# Altium project ADV7611.PrjPcb
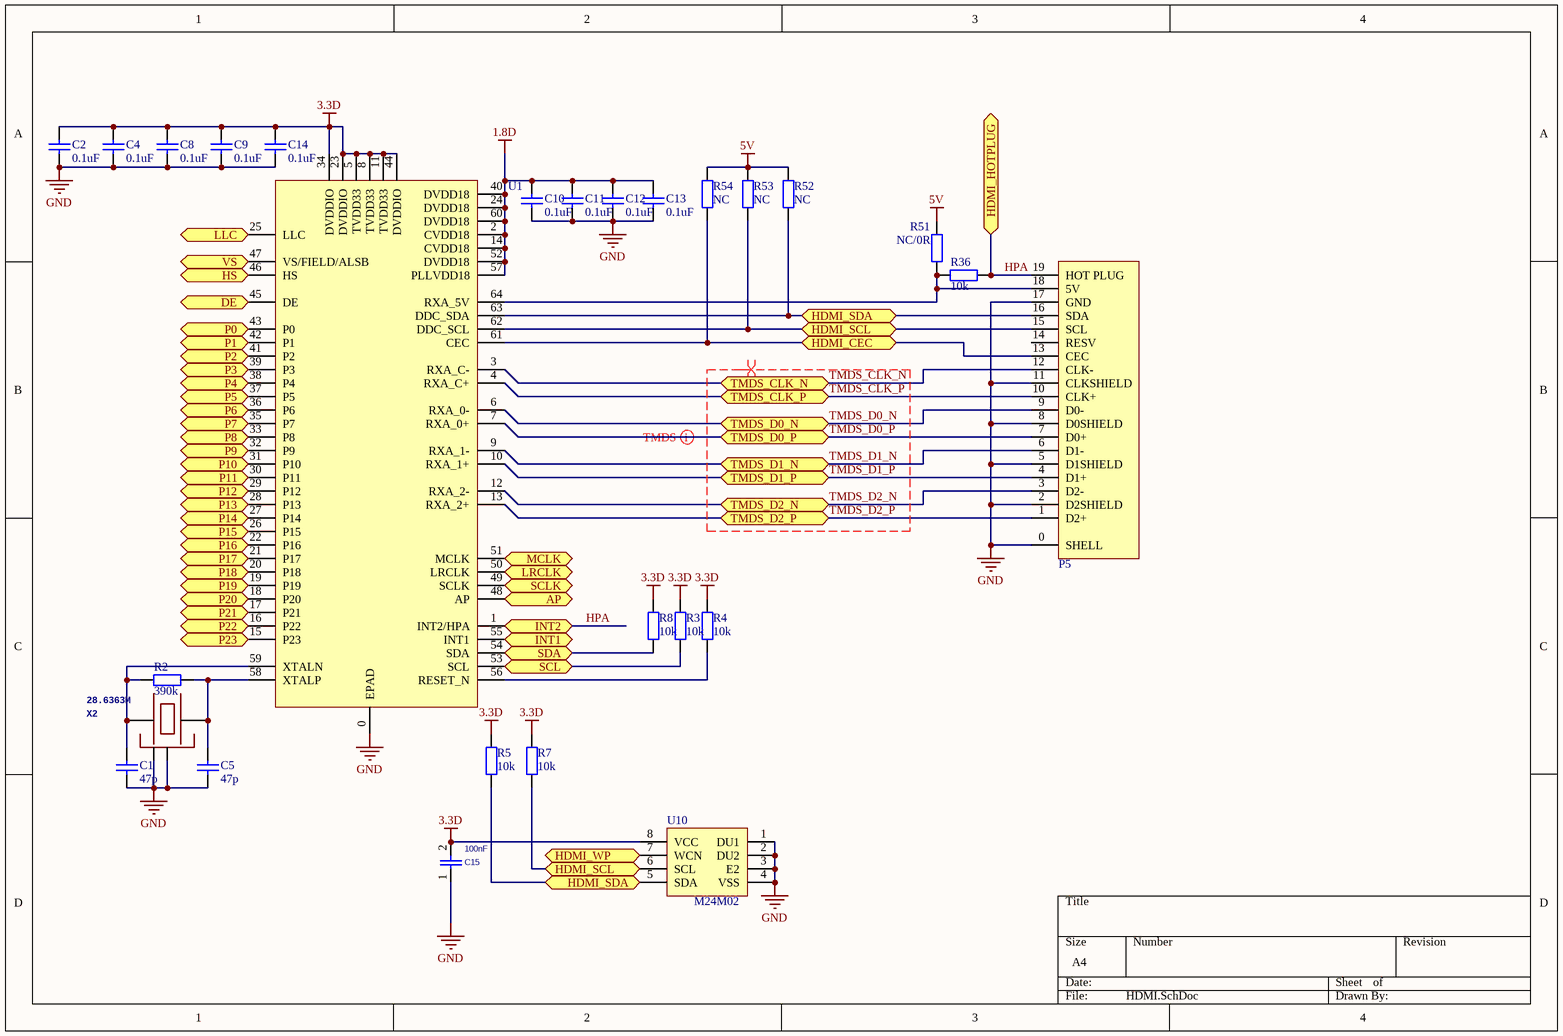
[diagram p0: HDMI.SchDoc]
3 sheets, 57 parts. Net scope: flat (ports and power ports of the same name join across sheets).
Board file: ADV7611.PcbDoc
Sheets:
  HDMI.SchDoc
  MCU.SchDoc
  interface.SchDoc

## Sheet HDMI.SchDoc
size A4

### Parts
C1  value 47p  [0402]  (hidden comment: Cap)
C2  value 0.1uF  [0402]  (hidden comment: Cap)
C4  value 0.1uF  [0402]  (hidden comment: Cap)
C5  value 47p  [0402]  (hidden comment: Cap)
C8  value 0.1uF  [0402]  (hidden comment: Cap)
C9  value 0.1uF  [0402]  (hidden comment: Cap)
C10  value 0.1uF  [0402]  (hidden comment: Cap)
C11  value 0.1uF  [0402]  (hidden comment: Cap)
C12  value 0.1uF  [0402]  (hidden comment: Cap)
C13  value 0.1uF  [0402]  (hidden comment: Cap)
C14  value 0.1uF  [0402]  (hidden comment: Cap)
C15  100nF  [0402]
P5  HDMI  [HDMI-A]  (value not drawn)
R2  390k  [0402]
R3  10k  [0402]
R4  10k  [0402]
R5  10k  [0402]
R7  10k  [0402]
R8  10k  [0402]
R36  10k  [0402]
R51  NC/0R  [0402]
R52  NC  [0402]
R53  NC  [0402]
R54  NC  [0402]
U1  ADV7611  [ADV7611]  (value not drawn)
U10  M24M02  [SO8]
X2  28.6363M  [OSCILLATOR-3.2X2.5]

### Ports
AP, DE, HDMI_CEC, HDMI_HOTPLUG, HDMI_SCL, HDMI_SDA, HDMI_WP, HS, INT1, INT2, LLC, LRCLK, MCLK, P0, P1, P2, P3, P4, P5, P6, P7, P8, P9, P10, P11, P12, P13, P14, P15, P16, P17, P18, P19, P20, P21, P22, P23, SCL, SCLK, SDA, TMDS_CLK_N, TMDS_CLK_P, TMDS_D0_N, TMDS_D0_P, TMDS_D1_N, TMDS_D1_P, TMDS_D2_N, TMDS_D2_P, VS

### Nets
1.8D: C10.2 C11.2 C12.2 C13.2 U1.2(CVDD18) U1.14(CVDD18) U1.24(DVDD18) U1.40(DVDD18) U1.52(DVDD18) U1.57(PLLVDD18) U1.60(DVDD18)
3.3D: C2.2 C4.2 C8.2 C9.2 C14.2 C15.2 R3.1 R4.1 R5.1 R7.1 R8.1 U1.5(TVDD33) U1.8(TVDD33) U1.11(TVDD33) U1.23(DVDDIO) U1.34(DVDDIO) U1.44(DVDDIO) U10.8(VCC)
5V: R51.2 R52.1 R53.1 R54.1
GND: C1.1 C2.1 C4.1 C5.1 C8.1 C9.1 C10.1 C11.1 C12.1 C13.1 C14.1 C15.1 P5.0(SHELL) P5.2(D2SHIELD) P5.5(D1SHIELD) P5.8(D0SHIELD) P5.11(CLKSHIELD) P5.17(GND) U1.0(EPAD) U10.1(DU1) U10.2(DU2) U10.3(E2) U10.4(VSS) X2.2(NC_2) X2.4(NC_4)
HPA: P5.19(HOT_PLUG) R36.1 U1.1(INT2/HPA) ; port HDMI_HOTPLUG, port INT2
TMDS_CLK_N: P5.12(CLK-) U1.3(RXA_C-) ; port TMDS_CLK_N
TMDS_CLK_P: P5.10(CLK+) U1.4(RXA_C+) ; port TMDS_CLK_P
TMDS_D0_N: P5.9(D0-) U1.6(RXA_0-) ; port TMDS_D0_N
TMDS_D0_P: P5.7(D0+) U1.7(RXA_0+) ; port TMDS_D0_P
TMDS_D1_N: P5.6(D1-) U1.9(RXA_1-) ; port TMDS_D1_N
TMDS_D1_P: P5.4(D1+) U1.10(RXA_1+) ; port TMDS_D1_P
TMDS_D2_N: P5.3(D2-) U1.12(RXA_2-) ; port TMDS_D2_N
TMDS_D2_P: P5.1(D2+) U1.13(RXA_2+) ; port TMDS_D2_P
NetC1_2: C1.2 R2.1 U1.59(XTALN) X2.1
NetC5_2: C5.2 R2.2 U1.58(XTALP) X2.3
NetP1_9: P5.15(SCL) R7.2 R53.2 U1.62(DDC_SCL) U10.6(SCL) ; port HDMI_SCL
NetP1_10: P5.16(SDA) R5.2 R52.2 U1.63(DDC_SDA) U10.5(SDA) ; port HDMI_SDA
NetP1_11: U1.46(HS) ; port HS
NetP1_13: U1.47(VS/FIELD/ALSB) ; port VS
NetP1_14: U1.45(DE) ; port DE
NetP1_15: R8.2 U1.54(SDA) ; port SDA
NetP1_16: R3.2 U1.53(SCL) ; port SCL
NetP1_29: U1.25(LLC) ; port LLC
NetP3_3: U1.43(P0) ; port P0
NetP3_4: U1.41(P2) ; port P2
NetP3_5: U1.38(P4) ; port P4
NetP3_6: U1.36(P6) ; port P6
NetP3_8: U1.33(P8) ; port P8
NetP3_9: U1.31(P10) ; port P10
NetP3_10: U1.29(P12) ; port P12
NetP3_11: U1.27(P14) ; port P14
NetP3_13: U1.22(P16) ; port P16
NetP3_14: U1.20(P18) ; port P18
NetP3_15: U1.18(P20) ; port P20
NetP3_16: U1.16(P22) ; port P22
NetP3_26: U1.15(P23) ; port P23
NetP3_27: U1.17(P21) ; port P21
NetP3_28: U1.19(P19) ; port P19
NetP3_29: U1.21(P17) ; port P17
NetP3_31: U1.26(P15) ; port P15
NetP3_32: U1.28(P13) ; port P13
NetP3_33: U1.30(P11) ; port P11
NetP3_34: U1.32(P9) ; port P9
NetP3_36: U1.35(P7) ; port P7
NetP3_37: U1.37(P5) ; port P5
NetP3_38: U1.39(P3) ; port P3
NetP3_39: U1.42(P1) ; port P1
NetP5_13: P5.13(CEC) R54.2 U1.61(CEC) ; port HDMI_CEC
NetP5_18: P5.18(5V) R36.2 R51.1 U1.64(RXA_5V)
NetR4_2: R4.2 U1.56(RESET_N)
NetU1_48: U1.48(AP) ; port AP
NetU1_49: U1.49(SCLK) ; port SCLK
NetU1_50: U1.50(LRCLK) ; port LRCLK
NetU1_51: U1.51(MCLK) ; port MCLK
NetU1_55: U1.55(INT1) ; port INT1
NetU10_7: U10.7(WCN) ; port HDMI_WP

Not connected (* = marked no-connect by the designer): P5 14(RESV)

### Layout directives
differential pair: TMDS_CLK_N, TMDS_CLK_P, TMDS_D0_N, TMDS_D0_P, TMDS_D1_N, TMDS_D1_P, TMDS_D2_N, TMDS_D2_P
net class TMDS: TMDS_D0_P

### Library data of the parts
C1 C2 C4 C5 C8-C14 = Cap: Capacitor; Published: 8-Jun-2000; LatestRevisionDate: 17-Jul-2002; LatestRevisionNote: Re-released for DXP Platform.; PackageReference: RAD-0.3; Publisher: Altium Limited; PackageDescription: Radial Cap, Thru-Hole; 2 Leads; 0.3 in Pin Spacing
C15 = CAP/0402: 1st Part Field: 0402
R2-R5 R7 R8 R36 R51-R54 = Res2: Resistor; Value: 0Ohm; Published: 8-Jun-2000; LatestRevisionDate: 17-Jul-2002; LatestRevisionNote: Re-released for DXP Platform.; PackageReference: AXIAL-0.4; Publisher: Altium Limited; PackageDescription: Axial Device, Thru-Hole; 2 Leads; 0.4 in Pin Spacing
X2 = OSCILLATOR-3.2X2.5: Crystal Oscillator in 3.2x2.5 SMD

## Sheet MCU.SchDoc
size A4
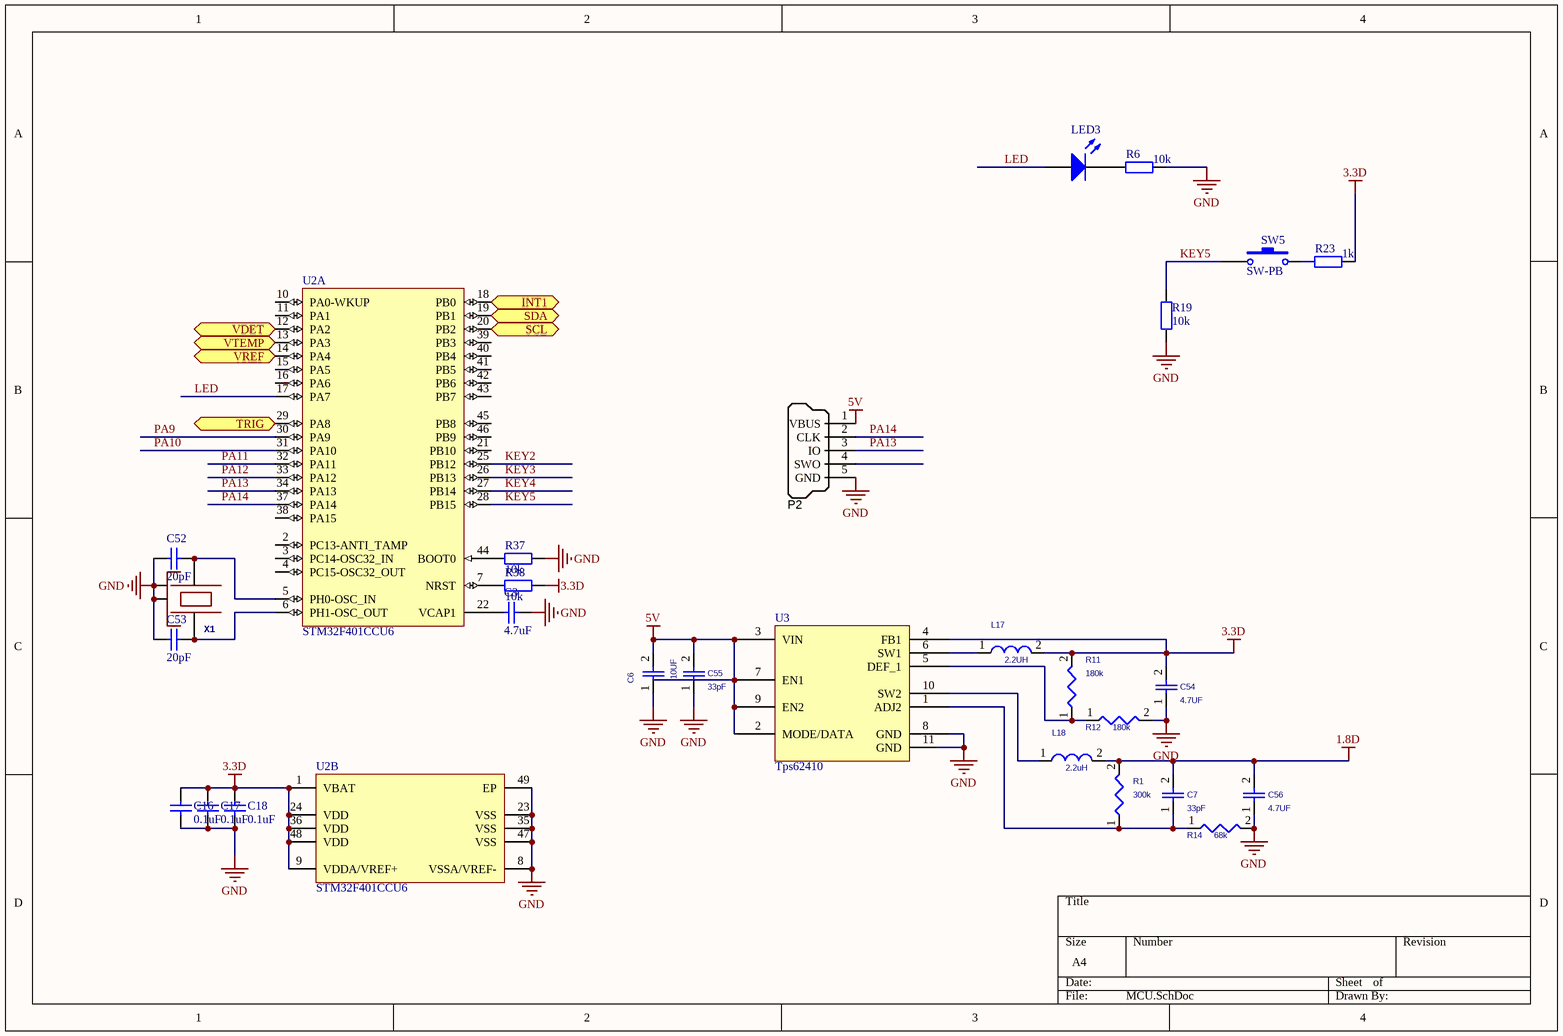
[diagram p1: MCU.SchDoc]

### Parts
C3  value 4.7uF  [0603]  (hidden comment: Cap)
C6  10UF  [0805]
C7  33pF  [0402]
C16  value 0.1uF  [0402]  (hidden comment: Cap)
C17  value 0.1uF  [0402]  (hidden comment: Cap)
C18  value 0.1uF  [0402]  (hidden comment: Cap)
C52  value 20pF  [0402]  (hidden comment: Cap)
C53  value 20pF  [0402]  (hidden comment: Cap)
C54  4.7UF  [0805]
C55  33pF  [0603L]
C56  4.7UF  [0805]
L17  2.2UH  [0806]
L18  2.2uH  [0806]
LED3  LED0  [0603]  (value not drawn)
P2  SWD_MicroUSB  [MICRO-YZX]  (value not drawn)
R1  300k  [0402]
R6  10k  [0402]
R11  180k  [0402]
R12  180k  [0402]
R14  68k  [0402]
R19  10k  [0402]
R23  1k  [0402]
R37  value 10k  [0402]  (hidden comment: Res2)
R38  value 10k  [0402]  (hidden comment: Res2)
SW5  SW-PB  [SW3x4]
U2  STM32F401CCU6  [STM-UFQFPN48_N]  (parts A,B of 2)
U3  Tps62410  [DFN-10P-3X3]
X1  24.000 KHz 3.2x2.5mm 8-10pf  [OSCILLATOR-3.2X2.5]  (value not drawn)

### Ports
INT1, SCL, SDA, TRIG, VDET, VREF, VTEMP

### Nets
1.8D: C7.2 C56.2 L18.2 R1.2
3.3D: C16.2 C17.2 C18.2 C54.2 L17.2 R11.2 R23.2 R38.1 U2.1(VBAT) U2.9(VDDA/VREF+) U2.24(VDD) U2.36(VDD) U2.48(VDD) U3.4(FB1)
5V: C6.2 C55.2 P2.1(VBUS) U3.2(MODE/DATA) U3.3(VIN) U3.7(EN1) U3.9(EN2)
GND: C3.1 C6.1 C16.1 C17.1 C18.1 C52.1 C53.1 C54.1 C55.1 C56.1 P2.5(GND) R6.2 R12.2 R14.2 R19.1 R37.2 U2.8(VSSA/VREF-) U2.23(VSS) U2.35(VSS) U2.47(VSS) U2.49(EP) U3.8(GND) U3.11(GND) X1.2(NC_2) X1.4(NC_4)
KEY2: U2.25(PB12)
KEY3: U2.26(PB13)
KEY4: U2.27(PB14)
KEY5: R19.2 SW5.1 U2.28(PB15)
LED: LED3.1(A) U2.17(PA7)
PA9: U2.30(PA9)
PA10: U2.31(PA10)
PA11: U2.32(PA11)
PA12: U2.33(PA12)
PA13: P2.3(IO) U2.34(PA13)
PA14: P2.2(CLK) U2.37(PA14)
NetC3_2: C3.2 U2.22(VCAP1)
NetC7_1: C7.1 R1.1 R14.1 U3.1(ADJ2)
NetC52_2: C52.2 U2.5(PH0-OSC_IN) X1.1
NetC53_2: C53.2 U2.6(PH1-OSC_OUT) X1.3
NetL17_1: L17.1 U3.6(SW1)
NetL18_1: L18.1 U3.10(SW2)
NetLED3_2: LED3.2(K) R6.1
NetP1_15: U2.19(PB1) ; port SDA
NetP1_16: U2.20(PB2) ; port SCL
NetR11_1: R11.1 R12.1 U3.5(DEF_1)
NetR23_1: R23.1 SW5.2
NetR37_1: R37.1 U2.44(BOOT0)
NetR38_2: R38.2 U2.7(NRST)
NetU1_55: U2.18(PB0) ; port INT1
NetU2_12: U2.12(PA2) ; port VDET
NetU2_13: U2.13(PA3) ; port VTEMP
NetU2_14: U2.14(PA4) ; port VREF
NetU2_29: U2.29(PA8) ; port TRIG

Not connected (* = marked no-connect by the designer): P2 4(SWO); U2 2(PC13-ANTI_TAMP) 3(PC14-OSC32_IN) 4(PC15-OSC32_OUT) 10(PA0-WKUP) 11(PA1) 15(PA5) 16(PA6) 21(PB10) 38(PA15) 39(PB3) 40(PB4) 41(PB5) 42(PB6) 43(PB7) 45(PB8) 46(PB9)

### Library data of the parts
C3 C16-C18 C52 C53 = Cap: Capacitor; Published: 8-Jun-2000; LatestRevisionDate: 17-Jul-2002; LatestRevisionNote: Re-released for DXP Platform.; PackageReference: RAD-0.3; Publisher: Altium Limited; PackageDescription: Radial Cap, Thru-Hole; 2 Leads; 0.3 in Pin Spacing
C6 C54-C56 = CAP/0402: 1st Part Field: 0402
C7 = CAP/0402: 1st Part Field: 0402
L17 L18 = L/2.5*2.0
LED3 = LED0: Typical INFRARED GaAs LED; Published: 8-Jun-2000; LatestRevisionDate: 08-Jul-2005; LatestRevisionNote: Mech Layer 1 removed.; PackageReference: LED-0; Publisher: Altium Limited; PackageDescription: LED; 2 Leads
P2 = SWD_MicroUSB: Connector SMD USB Micro Type B middle mount; Manufacturer 1: Molex Inc; SCDType: undef; Package / Case: SMD; Supplier 1: Digi-Key; Supplier Part Number 1: WM17142CT-ND
R1 R11 R12 R14 = RES/0402_3
R6 R19 R23 = Res2: Resistor; Value: 0Ohm; Published: 8-Jun-2000; LatestRevisionDate: 17-Jul-2002; LatestRevisionNote: Re-released for DXP Platform.; PackageReference: AXIAL-0.4; Publisher: Altium Limited; PackageDescription: Axial Device, Thru-Hole; 2 Leads; 0.4 in Pin Spacing
R37 R38 = Res2: Resistor; Published: 8-Jun-2000; LatestRevisionDate: 17-Jul-2002; LatestRevisionNote: Re-released for DXP Platform.; PackageReference: AXIAL-0.4; Publisher: Altium Limited; PackageDescription: Axial Device, Thru-Hole; 2 Leads; 0.4 in Pin Spacing
SW5 = SW-PB: Switch; Published: 24-Mar-1999; LatestRevisionDate: 17-Jul-2002; LatestRevisionNote: Re-released for DXP Platform.; PackageReference: SPST-2; Publisher: Altium Limited; PackageDescription: Switch; 2 Leads
U2 = STM32F401CCU6: ARM Cortex-M4 32-bit MCU+FPU, 105 DMIPS, 256 kB Flash, 64 kB Internal RAM, 36 I/Os, 48-pin UFQFPN, -40 to 85 degC, Tray; Manufacturer: STMicroelectronics; FLASH Size (Prog) (kB): 256; I/Os (High Current): 36; Internal RAM Size (kB): 64; Operating Frequency(F) (Processor speed) (MHz): 84; Supply Voltage(Vcc) max (V): 3.6; Supply Voltage(Vcc) min (V): 1.8; DatasheetVersion: Rev. 1; PackageVersion: Rev. 1, 04/2013; PackageReference: UFQFPN48; PackageDescription: 48-Pin Ultra Thin Fine Pitch Quad Flat No-Lead, 7 x 7 x 0.6 mm Body, 0.5 mm Pitch, Exposed Pad; Supplier 1: Newark; Supplier Part Number 1: 19X6217; Supplier 2: Mouser; Supplier Part Number 2: 511-STM32F401CCU6; Core: ARM Cortex-M4; Packing: Tray; Mounting Technology: Surface Mount; PartNumber: STM32F401CCU6; ComponentLink1Description: Manufacturer URL; ComponentLink1URL: http://www.st.com/web/en/home.html; ComponentLink2Description: Datasheet; ComponentLink2URL: http://www.st.com/st-web-ui/static/active/en/resource/technical/document/data_brief/DM00071938.pdf; ComponentLink3Description: Package Specification; ComponentLink3URL: http://www.st.com/st-web-ui/static/active/en/resource/technical/document/data_brief/DM00071938.pdf
X1 = OSCILLATOR-3.2X2.5: Crystal Oscillator in 3.2x2.5 SMD

## Sheet interface.SchDoc
size A4
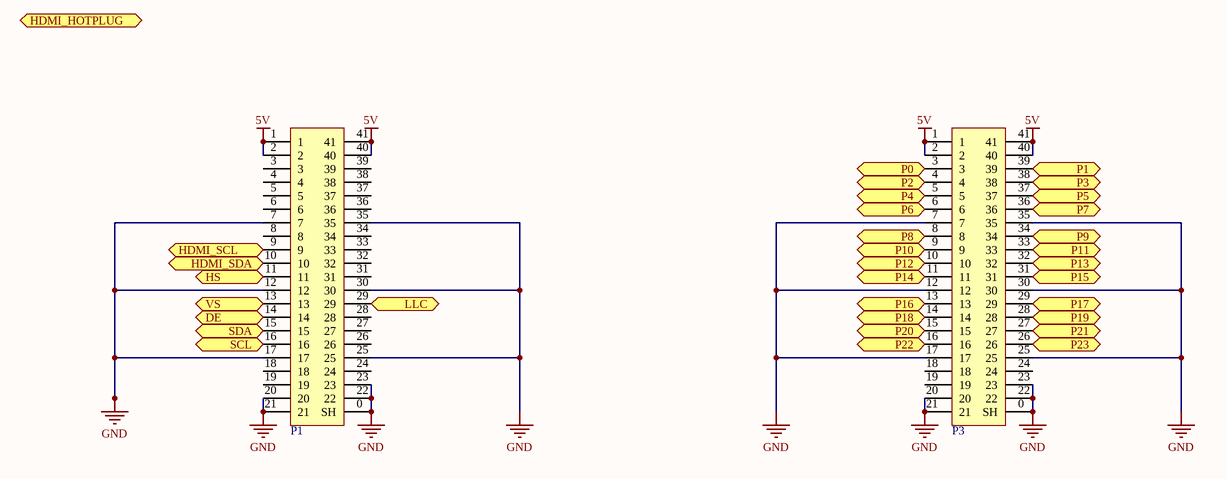
[diagram p2: interface.SchDoc]

### Parts
P1  DF9-41S  [DF9-41S]  (value not drawn)
P3  DF9-41S  [DF9-41S]  (value not drawn)

### Ports
DE, HDMI_HOTPLUG, HDMI_SCL, HDMI_SDA, HS, LLC, P0, P1, P2, P3, P4, P5, P6, P7, P8, P9, P10, P11, P12, P13, P14, P15, P16, P17, P18, P19, P20, P21, P22, P23, SCL, SDA, VS

### Nets
5V: P1.1 P1.2 P1.40 P1.41 P3.1 P3.2 P3.40 P3.41
GND: P1.0(SH) P1.7 P1.12 P1.17 P1.20 P1.21 P1.22 P1.23 P1.25 P1.30 P1.35 P3.0(SH) P3.7 P3.12 P3.17 P3.20 P3.21 P3.22 P3.23 P3.25 P3.30 P3.35
NetP1_9: P1.9 ; port HDMI_SCL
NetP1_10: P1.10 ; port HDMI_SDA
NetP1_11: P1.11 ; port HS
NetP1_13: P1.13 ; port VS
NetP1_14: P1.14 ; port DE
NetP1_15: P1.15 ; port SDA
NetP1_16: P1.16 ; port SCL
NetP1_29: P1.29 ; port LLC
NetP3_3: P3.3 ; port P0
NetP3_4: P3.4 ; port P2
NetP3_5: P3.5 ; port P4
NetP3_6: P3.6 ; port P6
NetP3_8: P3.8 ; port P8
NetP3_9: P3.9 ; port P10
NetP3_10: P3.10 ; port P12
NetP3_11: P3.11 ; port P14
NetP3_13: P3.13 ; port P16
NetP3_14: P3.14 ; port P18
NetP3_15: P3.15 ; port P20
NetP3_16: P3.16 ; port P22
NetP3_26: P3.26 ; port P23
NetP3_27: P3.27 ; port P21
NetP3_28: P3.28 ; port P19
NetP3_29: P3.29 ; port P17
NetP3_31: P3.31 ; port P15
NetP3_32: P3.32 ; port P13
NetP3_33: P3.33 ; port P11
NetP3_34: P3.34 ; port P9
NetP3_36: P3.36 ; port P7
NetP3_37: P3.37 ; port P5
NetP3_38: P3.38 ; port P3
NetP3_39: P3.39 ; port P1

Not connected (* = marked no-connect by the designer): P1 3 4 5 6 8 18 19 24 26 27 28 31 32 33 34 36 37 38 39; P3 18 19 24

## Nets that join several sheets
1.8D: HDMI (11 pins), MCU (C7.2 C56.2 L18.2 R1.2)
3.3D: HDMI (18 pins), MCU (14 pins)
5V: HDMI (R51.2 R52.1 R53.1 R54.1), MCU (7 pins), interface (8 pins)
GND: HDMI (25 pins), MCU (25 pins), interface (22 pins)
NetP1_9: HDMI (5 pins), interface (P1.9)
NetP1_10: HDMI (5 pins), interface (P1.10)
NetP1_11: HDMI (U1.46), interface (P1.11)
NetP1_13: HDMI (U1.47), interface (P1.13)
NetP1_14: HDMI (U1.45), interface (P1.14)
NetP1_15: HDMI (R8.2 U1.54), MCU (U2.19), interface (P1.15)
NetP1_16: HDMI (R3.2 U1.53), MCU (U2.20), interface (P1.16)
NetP1_29: HDMI (U1.25), interface (P1.29)
NetP3_3: HDMI (U1.43), interface (P3.3)
NetP3_4: HDMI (U1.41), interface (P3.4)
NetP3_5: HDMI (U1.38), interface (P3.5)
NetP3_6: HDMI (U1.36), interface (P3.6)
NetP3_8: HDMI (U1.33), interface (P3.8)
NetP3_9: HDMI (U1.31), interface (P3.9)
NetP3_10: HDMI (U1.29), interface (P3.10)
NetP3_11: HDMI (U1.27), interface (P3.11)
NetP3_13: HDMI (U1.22), interface (P3.13)
NetP3_14: HDMI (U1.20), interface (P3.14)
NetP3_15: HDMI (U1.18), interface (P3.15)
NetP3_16: HDMI (U1.16), interface (P3.16)
NetP3_26: HDMI (U1.15), interface (P3.26)
NetP3_27: HDMI (U1.17), interface (P3.27)
NetP3_28: HDMI (U1.19), interface (P3.28)
NetP3_29: HDMI (U1.21), interface (P3.29)
NetP3_31: HDMI (U1.26), interface (P3.31)
NetP3_32: HDMI (U1.28), interface (P3.32)
NetP3_33: HDMI (U1.30), interface (P3.33)
NetP3_34: HDMI (U1.32), interface (P3.34)
NetP3_36: HDMI (U1.35), interface (P3.36)
NetP3_37: HDMI (U1.37), interface (P3.37)
NetP3_38: HDMI (U1.39), interface (P3.38)
NetP3_39: HDMI (U1.42), interface (P3.39)
NetU1_55: HDMI (U1.55), MCU (U2.18)